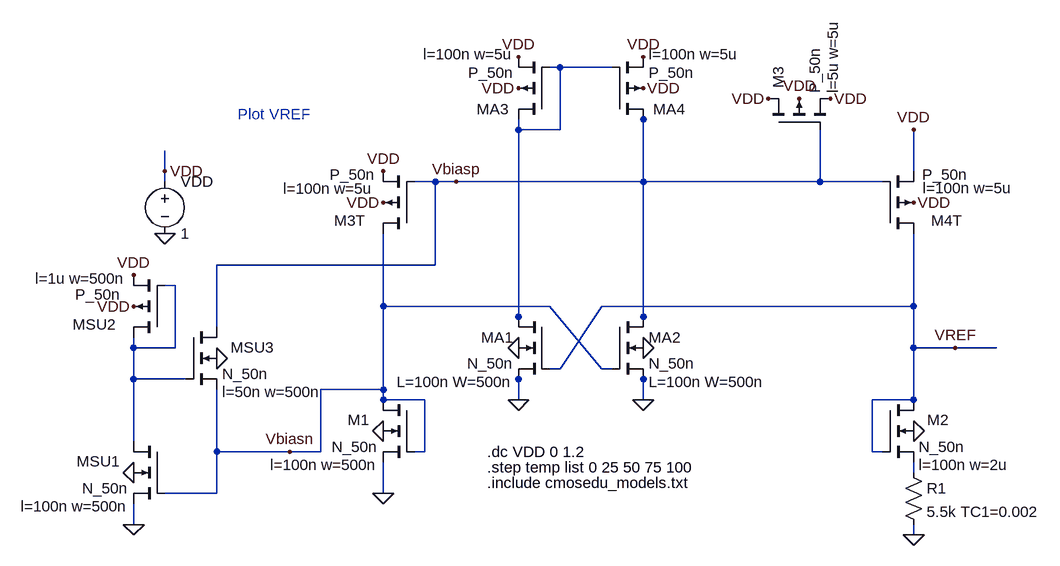
[diagram p0: schematic Fig23_14.asc]
Fig23_14.asc, the LTspice schematic file:
Version 4
SHEET 1 2876 680
WIRE 2048 -656 2032 -656
WIRE 2128 -656 2048 -656
WIRE 2464 -608 2448 -608
WIRE 2176 -576 2176 -592
WIRE 1984 -560 1984 -576
WIRE 2048 -560 2048 -656
WIRE 2048 -560 1984 -560
WIRE 1440 -496 1440 -528
WIRE 2592 -496 2592 -560
WIRE 1440 -480 1440 -496
WIRE 1856 -480 1824 -480
WIRE 1888 -480 1856 -480
WIRE 2176 -480 2176 -576
WIRE 2176 -480 1888 -480
WIRE 2448 -480 2448 -560
WIRE 2448 -480 2176 -480
WIRE 2544 -480 2448 -480
WIRE 1856 -352 1856 -480
WIRE 1856 -352 1520 -352
WIRE 1456 -320 1440 -320
WIRE 1776 -288 1776 -400
WIRE 2032 -288 1776 -288
WIRE 2592 -288 2592 -400
WIRE 2592 -288 2112 -288
WIRE 1984 -272 1984 -560
WIRE 2176 -272 2176 -480
WIRE 1520 -256 1520 -352
WIRE 1984 -256 1984 -272
WIRE 2176 -256 2176 -272
WIRE 1392 -224 1392 -240
WIRE 1456 -224 1456 -320
WIRE 1456 -224 1392 -224
WIRE 2592 -224 2592 -288
WIRE 2656 -224 2592 -224
WIRE 2720 -224 2656 -224
WIRE 2048 -192 2112 -288
WIRE 2048 -192 2032 -192
WIRE 2112 -192 2032 -288
WIRE 2128 -192 2112 -192
WIRE 1392 -176 1392 -224
WIRE 1472 -176 1392 -176
WIRE 1984 -176 1984 -192
WIRE 2176 -176 2176 -192
WIRE 1776 -160 1776 -288
WIRE 1776 -160 1680 -160
WIRE 1776 -144 1776 -160
WIRE 1840 -144 1776 -144
WIRE 1984 -144 1984 -176
WIRE 2176 -144 2176 -176
WIRE 2592 -144 2592 -224
WIRE 2592 -144 2528 -144
WIRE 1392 -80 1392 -176
WIRE 1520 -64 1520 -160
WIRE 1632 -64 1520 -64
WIRE 1680 -64 1680 -160
WIRE 1680 -64 1632 -64
WIRE 1840 -64 1840 -144
WIRE 1840 -64 1824 -64
WIRE 2528 -64 2528 -144
WIRE 2544 -64 2528 -64
WIRE 2592 -32 2592 -48
WIRE 1520 0 1520 -64
WIRE 1520 0 1440 0
WIRE 1776 0 1776 -48
WIRE 1392 48 1392 16
WIRE 2592 64 2592 48
FLAG 1440 -400 0
FLAG 1440 -496 VDD
FLAG 1392 -32 0
FLAG 1392 48 0
FLAG 1520 -208 0
FLAG 1392 -288 VDD
FLAG 1392 -336 VDD
FLAG 1776 -448 VDD
FLAG 1776 -496 VDD
FLAG 1632 -64 Vbiasn
FLAG 2592 -448 VDD
FLAG 2592 -560 VDD
FLAG 2592 -96 0
FLAG 2592 64 0
FLAG 1888 -480 Vbiasp
FLAG 1776 -96 0
FLAG 1776 0 0
FLAG 2656 -224 VREF
FLAG 2176 -624 VDD
FLAG 2176 -672 VDD
FLAG 1984 -624 VDD
FLAG 1984 -672 VDD
FLAG 1984 -224 0
FLAG 2176 -224 0
FLAG 1984 -144 0
FLAG 2176 -144 0
FLAG 2416 -608 VDD
FLAG 2368 -608 VDD
FLAG 2464 -608 VDD
SYMBOL voltage 1440 -496 R0
WINDOW 123 0 0 Left 2
WINDOW 39 0 0 Left 2
SYMATTR InstName VDD
SYMATTR Value 1
SYMBOL nmos4 1440 -80 M0
WINDOW 123 56 100 Left 2
WINDOW 0 69 31 Left 2
SYMATTR Value2 l=100n w=500n
SYMATTR InstName MSU1
SYMATTR Value N_50n
SYMBOL nmos4 1472 -256 R0
WINDOW 123 56 100 Left 2
WINDOW 0 69 31 Left 2
SYMATTR Value2 l=50n w=500n
SYMATTR InstName MSU3
SYMATTR Value N_50n
SYMBOL pmos4 1440 -240 R180
WINDOW 0 75 20 Left 2
WINDOW 3 61 91 Left 2
WINDOW 38 68 66 Left 2
SYMATTR InstName MSU2
SYMATTR Value l=1u w=500n
SYMATTR SpiceModel P_50n
SYMBOL pmos4 1824 -400 R180
WINDOW 0 75 20 Left 2
WINDOW 3 61 91 Left 2
WINDOW 123 63 69 Left 2
SYMATTR InstName M3T
SYMATTR Value P_50n
SYMATTR Value2 l=100n w=5u
SYMBOL pmos4 2544 -400 M180
WINDOW 0 75 20 Left 2
WINDOW 3 61 91 Left 2
WINDOW 123 62 70 Left 2
SYMATTR InstName M4T
SYMATTR Value P_50n
SYMATTR Value2 l=100n w=5u
SYMBOL nmos4 2544 -144 R0
WINDOW 123 56 100 Left 2
WINDOW 0 69 31 Left 2
SYMATTR Value2 l=100n w=2u
SYMATTR InstName M2
SYMATTR Value N_50n
SYMBOL nmos4 1824 -144 M0
WINDOW 123 56 100 Left 2
WINDOW 0 69 31 Left 2
SYMATTR Value2 l=100n w=500n
SYMATTR InstName M1
SYMATTR Value N_50n
SYMBOL res 2576 -48 R0
SYMATTR InstName R1
SYMATTR Value 5.5k TC1=0.002
SYMBOL pmos4 2128 -576 M180
WINDOW 0 63 16 Left 2
WINDOW 123 56 100 Left 2
SYMATTR InstName MA4
SYMATTR Value2 l=100n w=5u
SYMATTR Value P_50n
SYMBOL pmos4 2032 -576 R180
WINDOW 0 63 16 Left 2
WINDOW 123 56 100 Left 2
SYMATTR InstName MA3
SYMATTR Value2 l=100n w=5u
SYMATTR Value P_50n
SYMBOL nmos4 2032 -272 M0
WINDOW 123 56 100 Left 2
SYMATTR Value2 L=100n W=500n
SYMATTR InstName MA1
SYMATTR Value N_50n
SYMBOL nmos4 2128 -272 R0
WINDOW 123 56 100 Left 2
SYMATTR Value2 L=100n W=500n
SYMATTR InstName MA2
SYMATTR Value N_50n
SYMBOL pmos4 2368 -560 R270
WINDOW 0 63 16 Left 2
WINDOW 123 56 100 Left 2
SYMATTR InstName M3
SYMATTR Value2 l=5u w=5u
SYMATTR Value P_50n
TEXT 1936 -16 Left 2 !.include cmosedu_models.txt
TEXT 1552 -584 Left 2 ;Plot VREF
TEXT 1936 -64 Left 2 !.dc VDD 0 1.2
TEXT 1936 -40 Left 2 !.step temp list 0 25 50 75 100

The netlist it stands for:
* Fig23_14.asc
VDD VDD 0 1
MSU1 N002 Vbiasn 0 0 N_50n l=100n w=500n
MSU3 Vbiasp N002 Vbiasn 0 N_50n l=50n w=500n
MSU2 N002 N002 VDD VDD P_50n l=1u w=500n
M3T Vbiasn Vbiasp VDD VDD P_50n l=100n w=5u
M4T VREF Vbiasp VDD VDD P_50n l=100n w=5u
M2 VREF VREF N003 0 N_50n l=100n w=2u
M1 Vbiasn Vbiasn 0 0 N_50n l=100n w=500n
R1 N003 0 5.5k TC1=0.002
MA4 Vbiasp N001 VDD VDD P_50n l=100n w=5u
MA3 N001 N001 VDD VDD P_50n l=100n w=5u
MA1 N001 VREF 0 0 N_50n L=100n W=500n
MA2 Vbiasp Vbiasn 0 0 N_50n L=100n W=500n
M3 VDD Vbiasp VDD VDD P_50n l=5u w=5u
.model NMOS NMOS
.model PMOS PMOS
.lib standard.mos
.include cmosedu_models.txt
* Plot VREF
.dc VDD 0 1.2
.step temp list 0 25 50 75 100
.backanno
.end